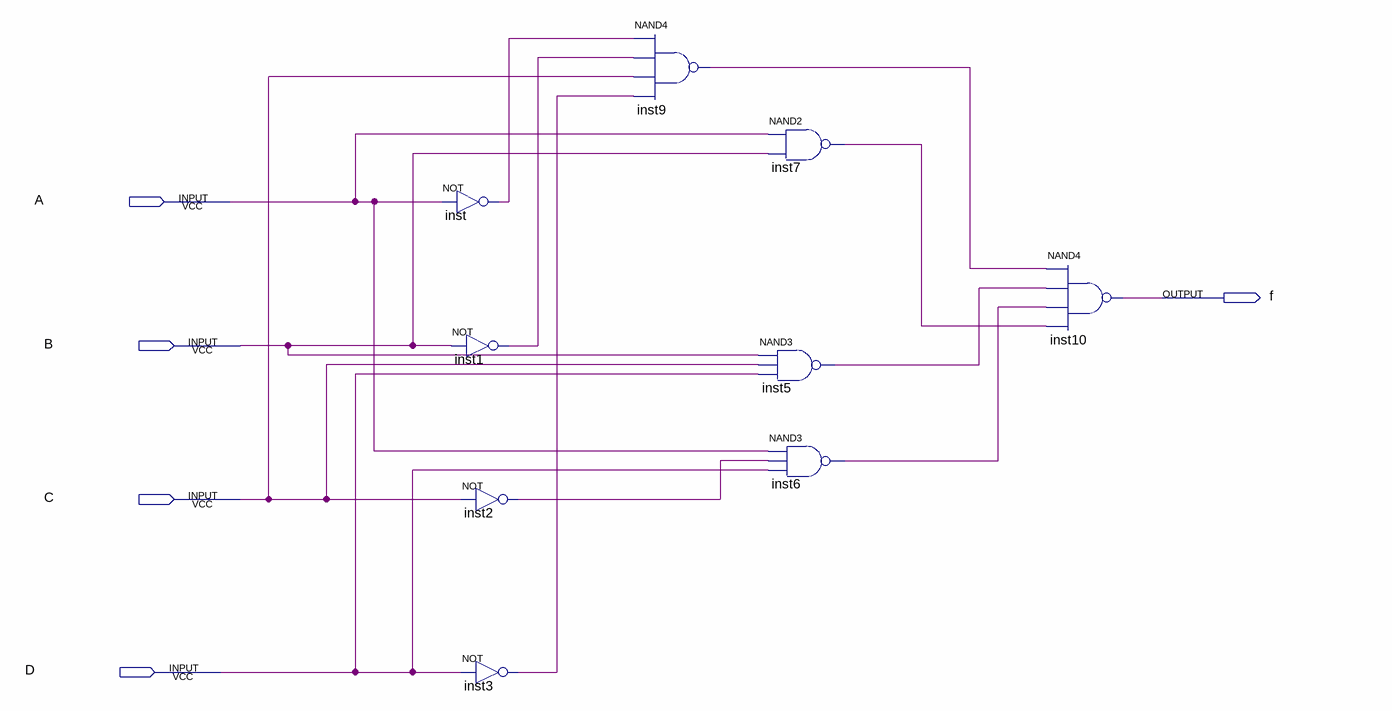
[diagram p0: schematic sheet]
// Quartus schematic Q9.bdf as structural Verilog: 9 symbols, 5 pins
module Q9 (
  input  A,
  input  B,
  input  C,
  input  D,
  output f
);

  wire inst1_out, inst2_out, inst3_out, inst5_out, inst6_out, inst7_out, inst9_out, inst_out;

  not inst (inst_out, A);
  not inst1 (inst1_out, B);
  not inst2 (inst2_out, C);
  not inst3 (inst3_out, D);
  nand inst9 (inst9_out, inst_out, inst1_out, C, inst3_out);
  nand inst7 (inst7_out, A, B);
  nand inst5 (inst5_out, B, C, D);
  nand inst6 (inst6_out, A, inst2_out, D);
  nand inst10 (f, inst9_out, inst5_out, inst6_out, inst7_out);
endmodule
